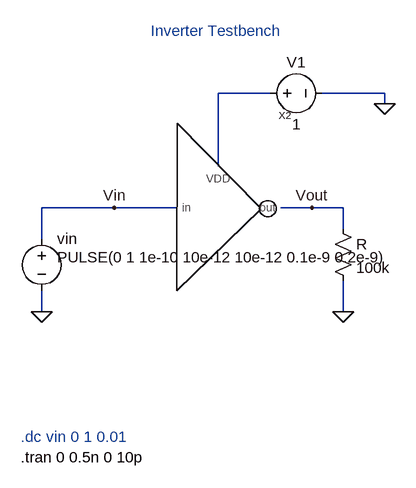
[diagram p0: schematic inverter_tb.asc]
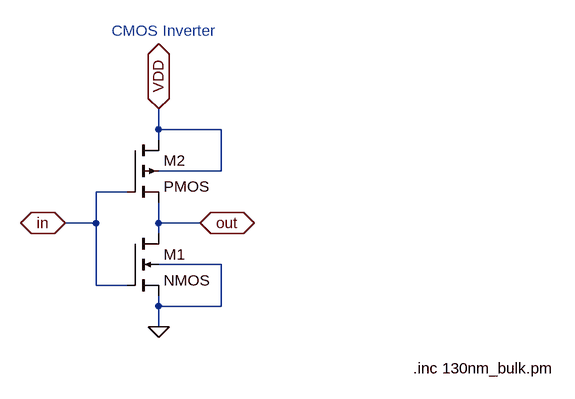
[diagram p1: sub-circuit inverter.asc]
inverter_tb.asc, the LTspice schematic file:
Version 4
SHEET 1 880 680
WIRE 304 0 224 0
WIRE 480 0 384 0
WIRE 480 16 480 0
WIRE 224 112 224 0
WIRE 64 176 -48 176
WIRE 160 176 64 176
WIRE 368 176 320 176
WIRE 416 176 368 176
WIRE 416 208 416 176
WIRE -48 224 -48 176
WIRE -48 336 -48 304
WIRE 416 336 416 288
FLAG -48 336 0
FLAG 480 16 0
FLAG 416 336 0
FLAG 64 176 Vin
FLAG 368 176 Vout
SYMBOL voltage -48 208 R0
WINDOW 3 24 44 Left 2
WINDOW 123 0 0 Left 0
WINDOW 39 0 0 Left 0
SYMATTR Value PULSE(0 1 1e-10 10e-12 10e-12 0.1e-9 0.2e-9)
SYMATTR InstName vin
SYMBOL voltage 288 0 R270
WINDOW 0 32 56 VTop 2
WINDOW 3 -32 56 VBottom 2
WINDOW 123 0 0 Left 0
WINDOW 39 0 0 Left 0
SYMATTR InstName V1
SYMATTR Value 1
SYMBOL res 400 192 R0
SYMATTR InstName R
SYMATTR Value 100k
SYMBOL inverter 208 160 R0
SYMATTR InstName X2
TEXT -80 528 Left 2 ;.dc vin 0 1 0.01
TEXT 120 -96 Left 2 ;Inverter Testbench
TEXT -80 560 Left 2 !.tran 0 0.5n 0 10p

inverter.asc, the sub-circuit schematic file:
Version 4
SHEET 1 880 680
WIRE 208 80 208 48
WIRE 304 80 208 80
WIRE 208 96 208 80
WIRE 304 144 304 80
WIRE 304 144 208 144
WIRE 160 176 112 176
WIRE 112 224 112 176
WIRE 112 224 64 224
WIRE 208 224 208 192
WIRE 272 224 208 224
WIRE 208 240 208 224
WIRE 304 288 208 288
WIRE 112 320 112 224
WIRE 160 320 112 320
WIRE 208 352 208 336
WIRE 304 352 304 288
WIRE 304 352 208 352
WIRE 208 384 208 352
FLAG 208 384 0
FLAG 64 224 in
IOPIN 64 224 BiDir
FLAG 272 224 out
IOPIN 272 224 BiDir
FLAG 208 48 VDD
IOPIN 208 48 BiDir
SYMBOL nmos4 160 240 R0
SYMATTR InstName M1
SYMATTR Value2 l=130n w=2u
SYMBOL pmos4 160 96 R0
SYMATTR InstName M2
SYMATTR Value2 l=130n w=6u
TEXT 600 448 Left 2 !.inc 130nm_bulk.pm
TEXT 136 -72 Left 2 ;CMOS Inverter

The netlist it stands for:
* inverter_tb.asc
vin Vin 0 PULSE(0 1 1e-10 10e-12 10e-12 0.1e-9 0.2e-9)
V1 N001 0 1
R Vout 0 100k
XX2 Vin Vout N001 inverter

* block symbol definitions
.subckt inverter in out VDD
M1 out in 0 0 NMOS l=130n w=2u
M2 VDD in out VDD PMOS l=130n w=6u
.inc 130nm_bulk.pm
* CMOS Inverter
.ends inverter

.model NMOS NMOS
.model PMOS PMOS
.lib standard.mos
* .dc vin 0 1 0.01
* Inverter Testbench
.tran 0 0.5n 0 10p
.backanno
.end